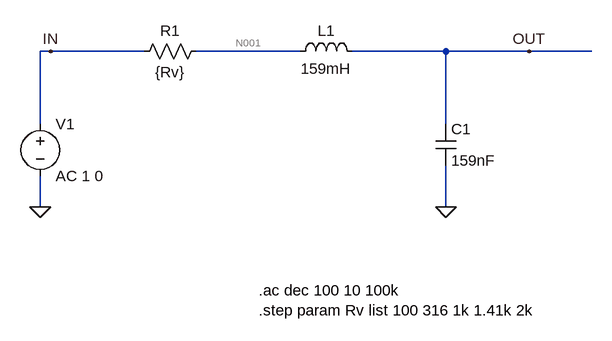
[diagram p0: schematic e1.asc]
e1.asc, the LTspice schematic file:
Version 4
SHEET 1 1108 680
WIRE 272 272 256 272
WIRE 416 272 272 272
WIRE 656 272 496 272
WIRE 880 272 736 272
WIRE 1008 272 880 272
WIRE 1104 272 1008 272
WIRE 256 384 256 272
WIRE 880 384 880 272
WIRE 256 512 256 464
WIRE 880 512 880 448
FLAG 256 512 0
FLAG 880 512 0
FLAG 1008 272 OUT
FLAG 272 272 IN
SYMBOL voltage 256 368 R0
SYMATTR InstName V1
SYMATTR Value AC 1 0
SYMBOL res 400 288 R270
WINDOW 0 32 56 VTop 2
WINDOW 3 0 56 VBottom 2
SYMATTR InstName R1
SYMATTR Value {Rv}
SYMBOL ind 640 288 R270
WINDOW 0 32 56 VTop 2
WINDOW 3 5 56 VBottom 2
SYMATTR InstName L1
SYMATTR Value 159mH
SYMBOL cap 864 384 R0
SYMATTR InstName C1
SYMATTR Value 159nF
TEXT 592 640 Left 2 !.ac dec 100 10 100k\n.step param Rv list 100 316 1k 1.41k 2k

The netlist it stands for:
* e1.asc
V1 IN 0 AC 1 0
R1 IN N001 {Rv}
L1 N001 OUT 159mH
C1 OUT 0 159nF
.ac dec 100 10 100k
.step param Rv list 100 316 1k 1.41k 2k
.backanno
.end

* Results of the author's LTspice run, read from the files saved beside the schematic
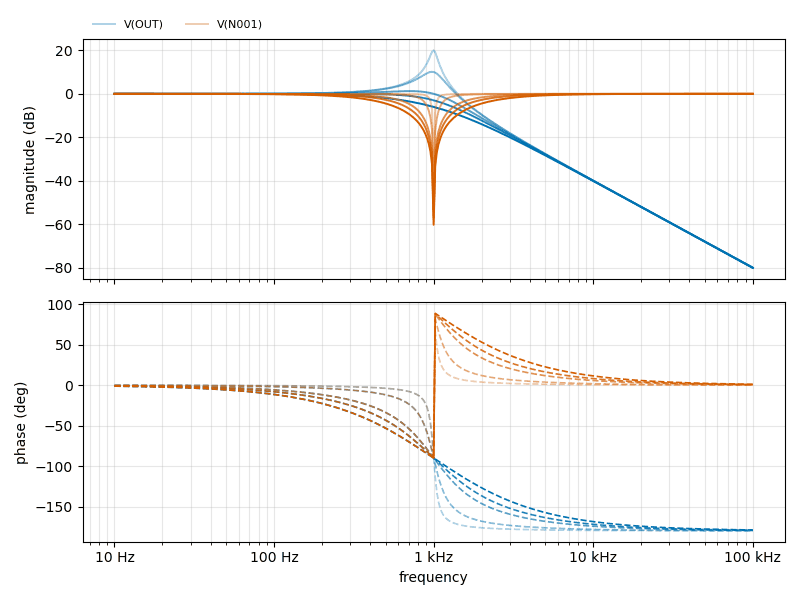
[diagram p1: AC Analysis of e1.asc, plotted from the saved traces]
* AC Analysis, 5 runs:
*   V(OUT) [rv=100]: 0.00 dB at 10 Hz, -79.98 dB at 100 kHz, peak 20.01 dB at 1 kHz, 3 dB below the peak at 946.8 Hz and 1.047 kHz
*   V(OUT) [rv=316]: 0.00 dB at 10 Hz, -79.98 dB at 100 kHz, peak 10.12 dB at 977.2 Hz, 3 dB below the peak at 799.5 Hz and 1.124 kHz
*   V(OUT) [rv=1000]: 0.00 dB at 10 Hz, -79.98 dB at 100 kHz, peak 1.25 dB at 707.9 Hz, 3 dB below the peak at 1.17 kHz
*   V(OUT) [rv=1410]: 0.00 dB at 10 Hz, -79.98 dB at 100 kHz, peak 0.00 dB at 77.62 Hz, 3 dB below the peak at 1.004 kHz
*   V(OUT) [rv=2000]: -0.00 dB at 10 Hz, -79.98 dB at 100 kHz, peak -0.00 dB at 10 Hz, 3 dB below the peak at 644.3 Hz
*   V(N001) [rv=100]: -0.00 dB at 10 Hz, -0.00 dB at 100 kHz, peak -0.00 dB at 10 Hz, 3 dB below the peak at 951 Hz
*   V(N001) [rv=316]: -0.00 dB at 10 Hz, -0.00 dB at 100 kHz, peak -0.00 dB at 10 Hz, 3 dB below the peak at 854.8 Hz
*   V(N001) [rv=1000]: -0.00 dB at 10 Hz, -0.00 dB at 100 kHz, peak -0.00 dB at 10 Hz, 3 dB below the peak at 618.6 Hz
*   V(N001) [rv=1410]: -0.00 dB at 10 Hz, -0.00 dB at 100 kHz, peak -0.00 dB at 10 Hz, 3 dB below the peak at 519 Hz
*   V(N001) [rv=2000]: -0.00 dB at 10 Hz, -0.00 dB at 100 kHz, peak -0.00 dB at 10 Hz, 3 dB below the peak at 414.7 Hz